# EAGLE design 4X EGT Display Meduino (EAGLE 9.0.1)
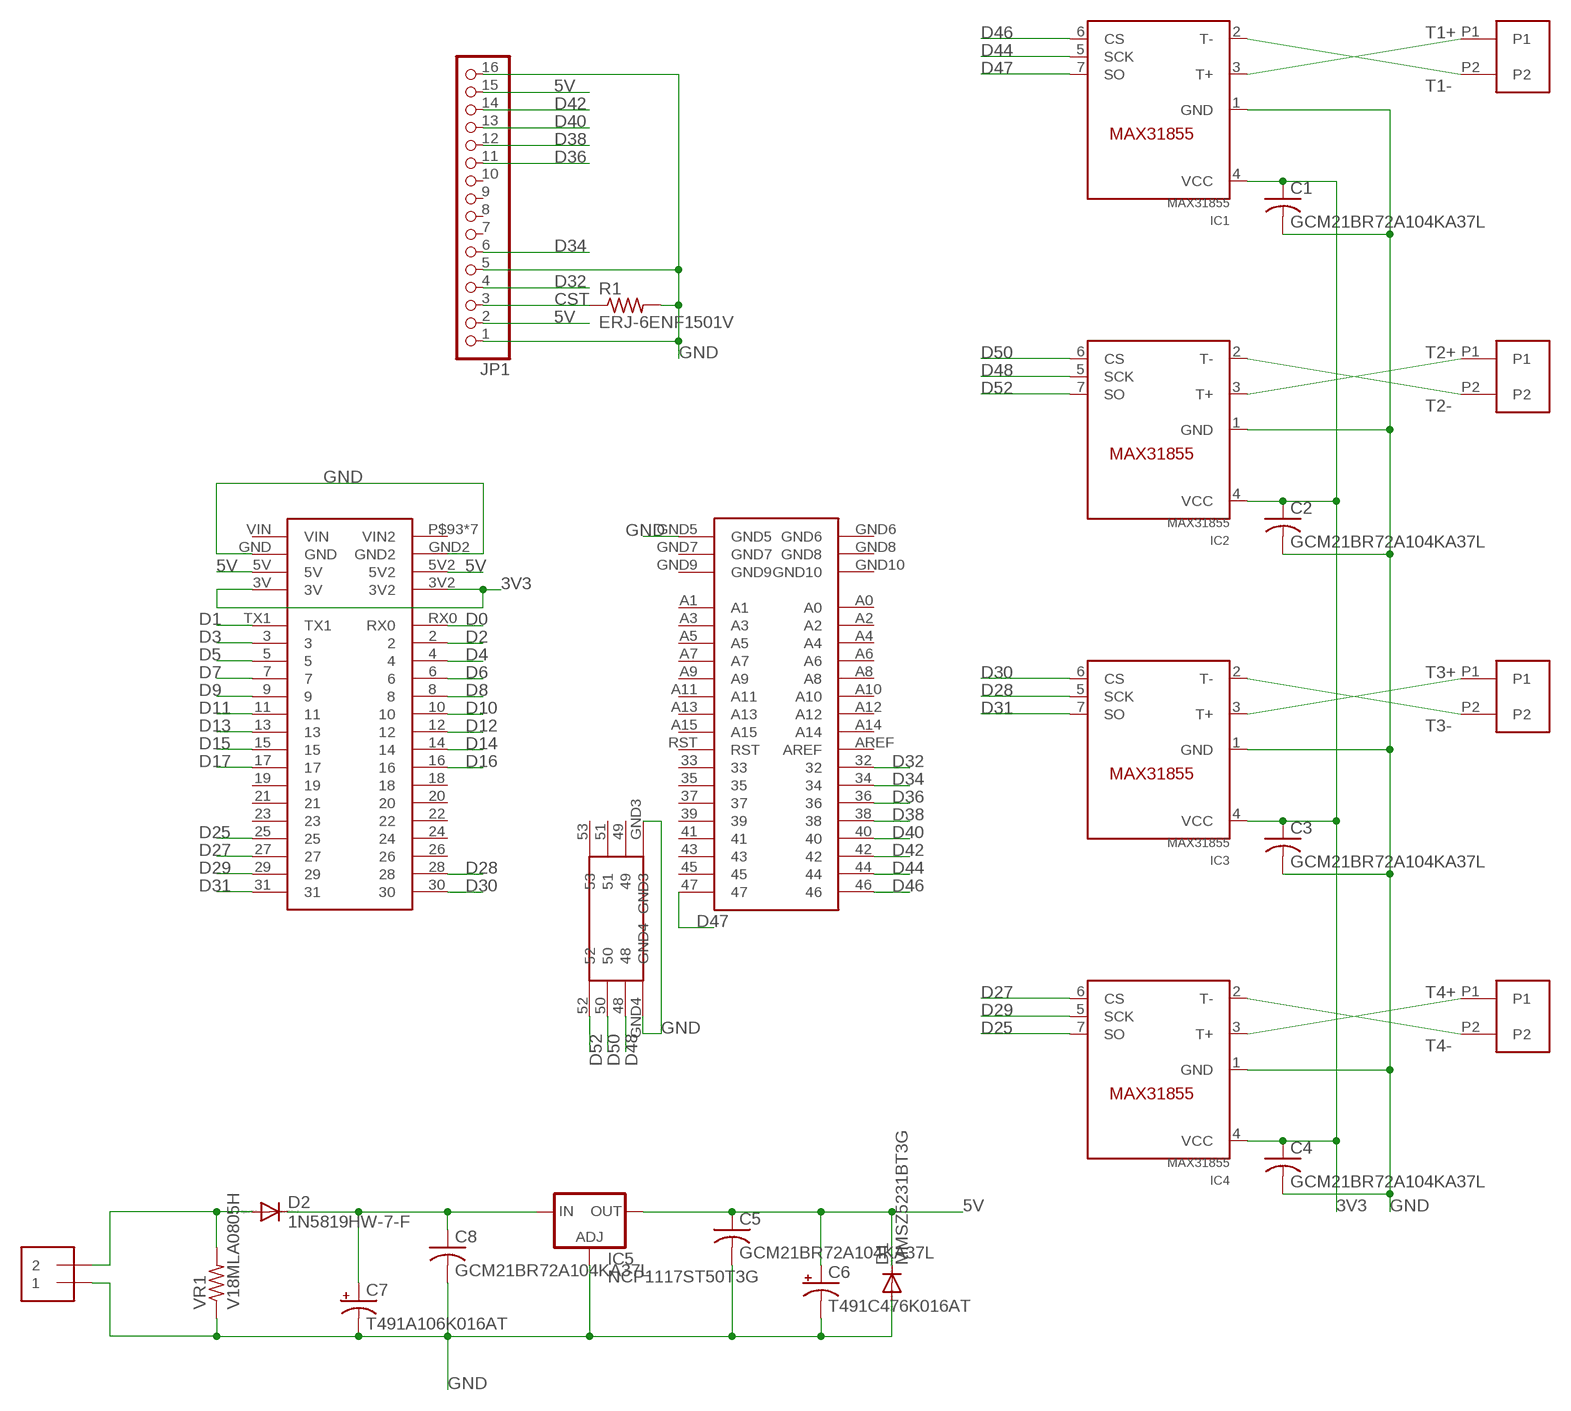
[diagram p0: schematic, sheet 1]

## Parts
C1  GCM21BR72A104KA37L  C-USC0805K  [C0805K]
C2  GCM21BR72A104KA37L  C-USC0805K  [C0805K]
C3  GCM21BR72A104KA37L  C-USC0805K  [C0805K]
C4  GCM21BR72A104KA37L  C-USC0805K  [C0805K]
C5  GCM21BR72A104KA37L  C-USC0805K  [C0805K]
C6  T491C476K016AT  CPOL-USCT6032  [CT6032]
C7  T491A106K016AT  CPOL-USA/3216-18R  [A/3216-18R]
C8  GCM21BR72A104KA37L  C-USC0805K  [C0805K]
D1  MMSZ5231BT3G  DIODE-SOD123  [SOD123]
D2  1N5819HW-7-F  DIODE-SOD123  [SOD123]
IC1  MAX31855  [SOIC8]
IC2  MAX31855  [SOIC8]
IC3  MAX31855  [SOIC8]
IC4  MAX31855  [SOIC8]
IC5  NCP1117ST50T3G  LD117AS50TR  [SOT223]
JP1  PINHD-1X16  [1X16]
PWR  1X2-3.5MM  [1X2-3.5MM]
R1  ERJ-6ENF1501V  R-US_R0805  [R0805]
T1  SPTAF_2  [SPTAF_2]
T2  SPTAF_2  [SPTAF_2]
T3  SPTAF_2  [SPTAF_2]
T4  SPTAF_2  [SPTAF_2]
U$1  MEDUINO  [MEDUINO]
VR1  V18MLA0805H  R-US_R0805  [R0805]

## Nets
3V3: C1.1 C2.1 C3.1 C4.1 IC1.4(VCC) IC2.4(VCC) IC3.4(VCC) IC4.4(VCC) U$1.3V U$1.3V2
5V: C5.1 C6.+ D1.C IC5.4(OUT) JP1.2 JP1.15 U$1.5V U$1.5V2
12V: C7.+ C8.1 D2.C IC5.3(IN)
12V-RAW: D2.A PWR.2 VR1.2
CST: JP1.3 R1.1
D0: U$1.RX0
D1: U$1.TX1
D2: U$1.2
D3: U$1.3
D4: U$1.4
D5: U$1.5
D6: U$1.6
D7: U$1.7
D8: U$1.8
D9: U$1.9
D10: U$1.10
D11: U$1.11
D12: U$1.12
D13: U$1.13
D14: U$1.14
D15: U$1.15
D16: U$1.16
D17: U$1.17
D25: IC4.7(SO) U$1.25
D27: IC4.6(CS) U$1.27
D28: IC3.5(SCK) U$1.28
D29: IC4.5(SCK) U$1.29
D30: IC3.6(CS) U$1.30
D31: IC3.7(SO) U$1.31
D32: JP1.4 U$1.32
D34: JP1.6 U$1.34
D36: JP1.11 U$1.36
D38: JP1.12 U$1.38
D40: JP1.13 U$1.40
D42: JP1.14 U$1.42
D44: IC1.5(SCK) U$1.44
D46: IC1.6(CS) U$1.46
D47: IC1.7(SO) U$1.47
D48: IC2.5(SCK) U$1.48
D50: IC2.6(CS) U$1.50
D52: IC2.7(SO) U$1.52
GND: C1.2 C2.2 C3.2 C4.2 C5.2 C6.- C7.- C8.2 D1.A IC1.1(GND) IC2.1(GND) IC3.1(GND) IC4.1(GND) IC5.1(ADJ) JP1.1 JP1.5 JP1.16 PWR.1 R1.2 U$1.GND U$1.GND2 U$1.GND3 U$1.GND4 U$1.GND5 VR1.1
T1+: IC1.3(T+) T1.P1
T1-: IC1.2(T-) T1.P2
T2+: IC2.3(T+) T2.P1
T2-: IC2.2(T-) T2.P2
T3+: IC3.3(T+) T3.P1
T3-: IC3.2(T-) T3.P2
T4+: IC4.3(T+) T4.P1
T4-: IC4.2(T-) T4.P2
Unconnected: JP1.7 JP1.8 JP1.9 JP1.10 U$1.18 U$1.19 U$1.20 U$1.21 U$1.22 U$1.23 U$1.24 U$1.26 U$1.33 U$1.35 U$1.37 U$1.39 U$1.41 U$1.43 U$1.45 U$1.49 U$1.51 U$1.53 U$1.A0 U$1.A1 U$1.A2 U$1.A3 U$1.A4 U$1.A5 U$1.A6 U$1.A7 U$1.A8 U$1.A9 U$1.A10 U$1.A11 U$1.A12 U$1.A13 U$1.A14 U$1.A15 U$1.AREF U$1.GND6 U$1.GND7 U$1.GND8 U$1.GND9 U$1.GND10 U$1.P$93(VIN2) U$1.P$94(VIN2) U$1.P$95(VIN2) U$1.P$96(VIN2) U$1.P$97(VIN2) U$1.P$98(VIN2) U$1.RST U$1.VIN U$1.VIN2

## Library data of the parts
C1-C5 C8 = adafruit:C-US: CAPACITOR, American symbol
C6 C7 = adafruit:CPOL-US: POLARIZED CAPACITOR, American symbol
D1 D2 = diode:DIODE-: DIODE
IC1-IC4 = AlexW-Eagle-Libraries:MAX31855
IC5 = v-reg:LD117A?*: Low drop fixed and adjustable positive voltage regulators 1 A Source: http://www.st.com/stonline/products/literature/ds/7194/ld1117axx.pdf
JP1 = pinhead:PINHD-1X16: PIN HEADER
PWR = adafruit:1X2: 3.5mm Terminal block http://www.ladyada.net/library/pcb/eaglelibrary.html
R1 VR1 = adafruit:R-US_: RESISTOR, American symbol
T1-T4 = SPTAF:SPTAF_2
U$1 = MEDUINO:MEDUINO

## Board
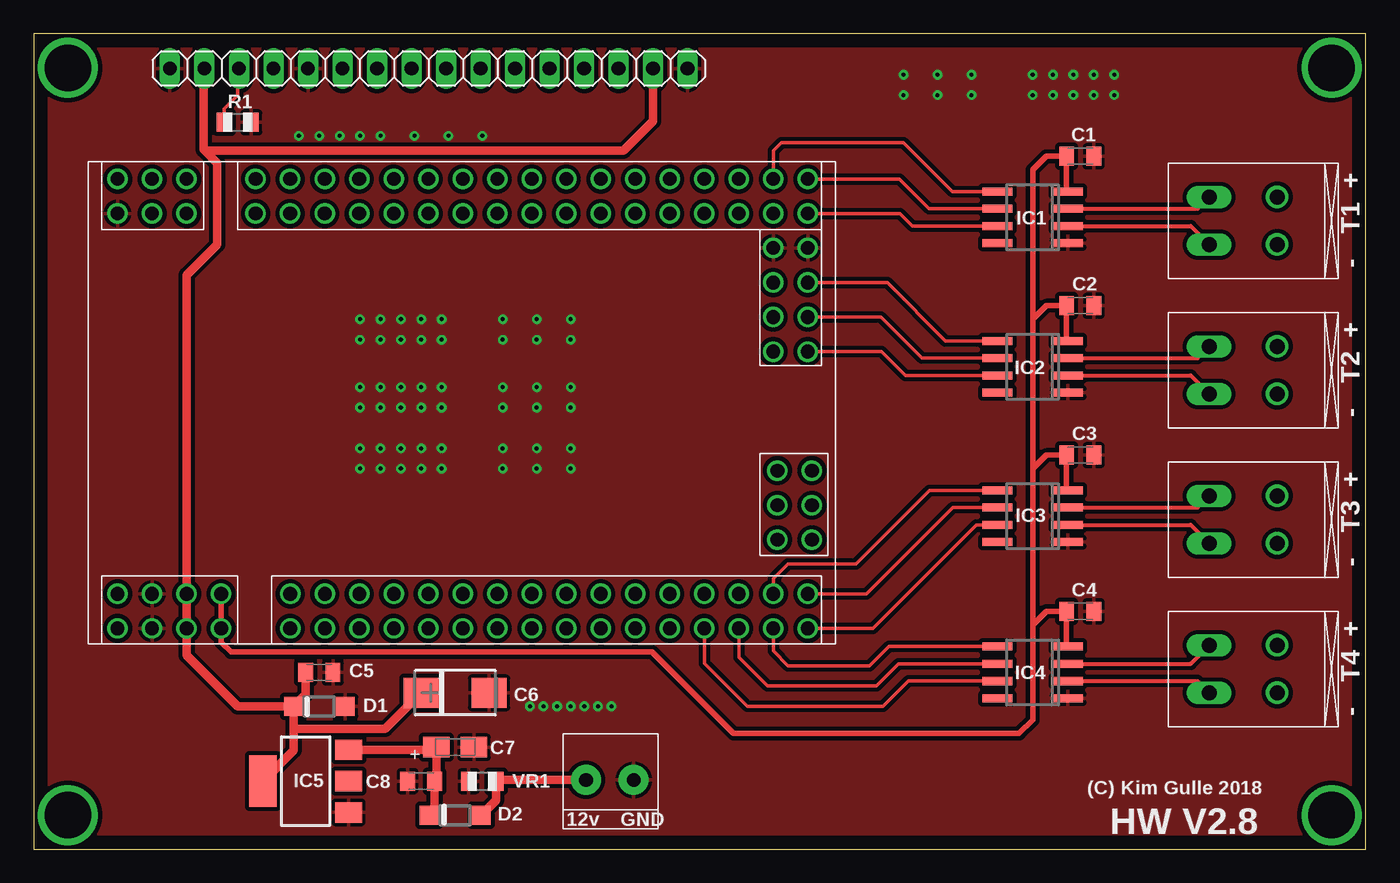
[diagram p1: board, top side]
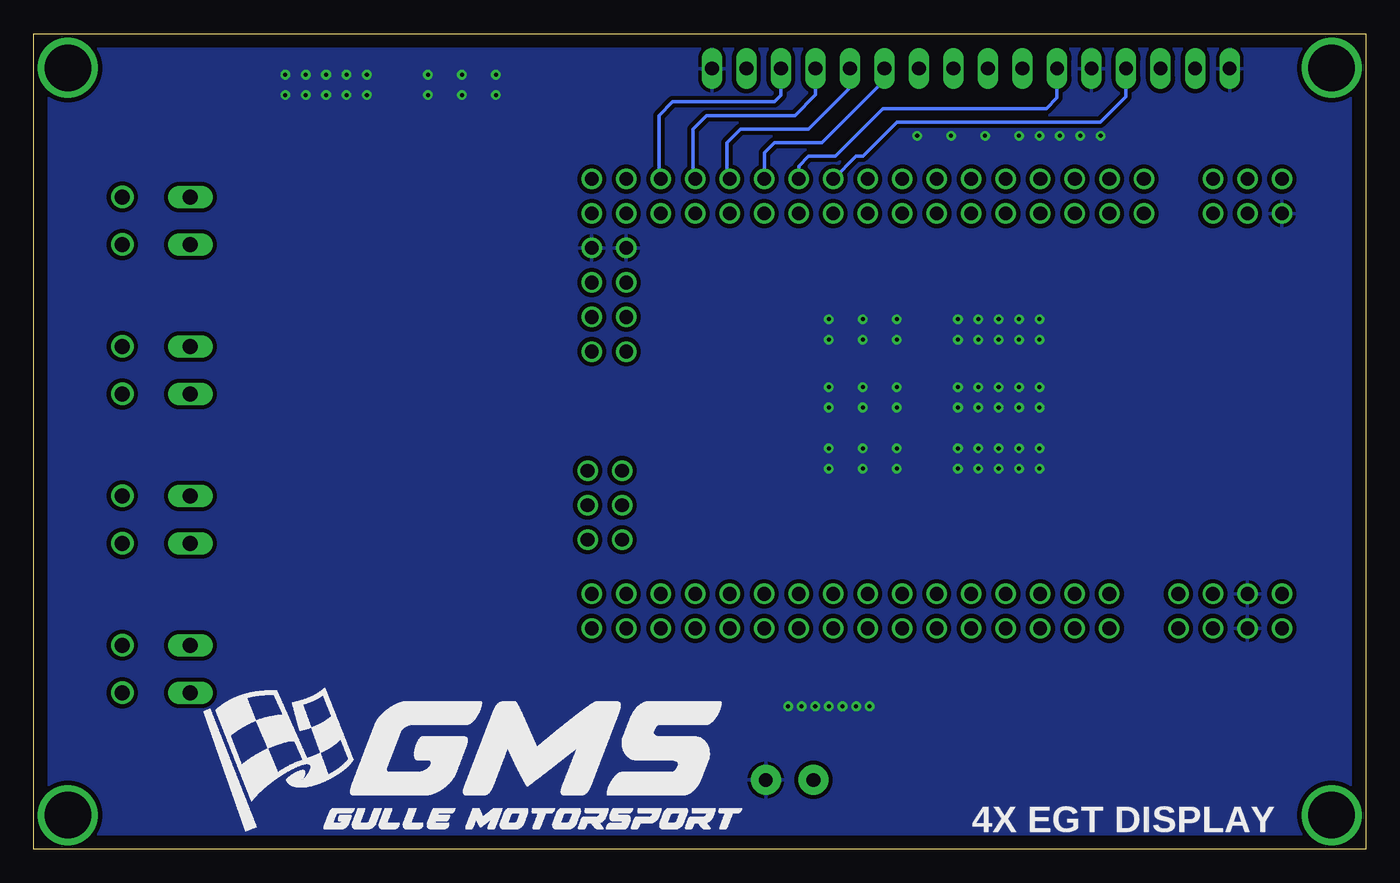
[diagram p2: board, bottom side, seen from below]

Size 98 x 60 mm. Coordinates in mm from the lower left corner, seen from the top.
Outline: 0,0 98,0 98,60 0,60 0,0
Copper layers (1*16): Top 0.035mm / dielectric 1.5mm / Bottom 0.035mm
Design rules "default *": minimum track width 6mil, minimum drill 0.35mm, track to track 12mil, track to pad 12mil, pad to pad 12mil, via to via 12mil, smd to smd 12mil, copper to edge 40mil, drill to drill 12mil, minimum pad ring 10mil, minimum via ring 8mil, stop-mask expansion 4mil, vias tented up to drill 20mil, thermal gap 10mil

### Footprints (pad centres in the part's own frame; a part is rotated, then mirrored left to right if it is on the bottom)
C0805K = smd 1.1 x 1.4: 1 -1,0; 2 1,0
CT6032 = smd 2.6 x 2.2: + 2.5,0; - -2.5,0
A/3216-18R = smd 1.95 x 1.5: + 1.375,0; - -1.375,0
SOD123 = smd 1.4 x 1.4: A 1.9,0; C -1.9,0
SOIC8 = smd 0.6 x 2.2: 1 -1.905,-2.6; 2 -0.635,-2.6; 3 0.635,-2.6; 4 1.905,-2.6; 5 1.905,2.6; 6 0.635,2.6; 7 -0.635,2.6; 8 -1.905,2.6
SOT223 = smd 1.5 x 2: 1 -2.3,-3.15; 2 0,-3.15; 3 2.3,-3.15 | smd 3.8 x 2: 4 0,3.15
1X16 = drill 1.016 long: 1 -19.05,0; 2 -16.51,0; 3 -13.97,0; 4 -11.43,0; 5 -8.89,0; 6 -6.35,0; 7 -3.81,0; 8 -1.27,0; 9 1.27,0; 10 3.81,0; 11 6.35,0; 12 8.89,0; 13 11.43,0; 14 13.97,0; 15 16.51,0; 16 19.05,0
1X2-3.5MM = drill 1 pad 2.184: 1 1.8,0; 2 -1.7,0
R0805 = smd 1.1 x 1.4: 1 -1,0; 2 1,0
SPTAF_2 = drill 1.1 long: P1 21,21; P2 21,17.5 | drill 1.1: P$3 26,17.5; P$4 26,21
MEDUINO = drill 1: 2 -20.318,5.083; 3 -22.858,5.083; 3V -22.858,12.703; 3V2 -20.318,12.703; 4 -20.318,2.543; 5 -22.858,2.543; 5V -22.858,15.243; 5V2 -20.318,15.243; 6 -20.318,0.003; 7 -22.858,0.003; 8 -20.318,-2.537; 9 -22.858,-2.537; 10 -20.318,-5.077; 11 -22.858,-5.077; 12 -20.318,-7.617; 13 -22.858,-7.617; 14 -20.318,-10.157; 15 -22.858,-10.157; 16 -20.318,-12.697; 17 -22.858,-12.697; 18 -20.318,-15.237; 19 -22.858,-15.237; 20 -20.318,-17.777; 21 -22.858,-17.777; 22 -20.318,-20.317; 23 -22.858,-20.317; 24 -20.318,-22.857; 25 -22.858,-22.857; 26 -20.318,-25.397; 27 -22.858,-25.397; 28 -20.318,-27.937; 29 -22.858,-27.937; 30 -20.318,-30.477; 31 -22.858,-30.477; 32 10.22,-12.693; 33 7.68,-12.693; 34 10.22,-15.233; 35 7.68,-15.233; 36 10.22,-17.773; 37 7.68,-17.773; 38 10.22,-20.313; 39 7.68,-20.313; 40 10.22,-22.853; 41 7.68,-22.853; 42 10.22,-25.393; 43 7.68,-25.393; 44 10.22,-27.933; 45 7.68,-27.933; 46 10.22,-30.473; 47 7.68,-30.473; 48 2.6,-30.473; 49 2.6,-27.933; 50 0.06,-30.473; 51 0.06,-27.933; 52 -2.48,-30.473; 53 -2.48,-27.933; A0 10.22,10.167; A1 7.68,10.167; A2 10.22,7.627; A3 7.68,7.627; A4 10.22,5.087; A5 7.68,5.087; A6 10.22,2.547; A7 7.68,2.547; A8 10.22,0.007; A9 7.68,0.007; A10 10.22,-2.533; A11 7.68,-2.533; A12 10.22,-5.073; A13 7.68,-5.073; A14 10.22,-7.613; A15 7.68,-7.613; AREF 10.22,-10.153; GND -22.858,17.783; GND2 -20.318,17.783; GND3 5.14,-27.933; GND4 5.14,-30.473; GND5 7.68,20.327; GND6 10.22,20.327; GND7 7.68,17.787; GND8 10.22,17.787; GND9 7.68,15.247; GND10 10.22,15.247; P$93 -16.323,-30.778; P$94 -13.783,-30.778; P$95 -11.243,-30.778; P$96 -16.323,-28.238; P$97 -13.783,-28.238; P$98 -11.243,-28.238; RST 7.68,-10.153; RX0 -20.318,7.623; TX1 -22.858,7.623; VIN -22.858,20.323; VIN2 -20.318,20.323

### Placement (x,y rotation side)
C1  77,51 0 top
C2  77,40 0 top
C3  77,29 0 top
C4  77,17.5 0 top
C5  21,13 0 top
C6  31,11.5 180 top
C7  31,7.5 180 top
C8  28.5,5 180 top
D1  21,10.5 0 top
D2  31,2.5 0 top
IC1  73.5,46.5 90 top
IC2  73.5,35.5 90 top
IC3  73.5,24.5 90 top
IC4  73.5,13 90 top
IC5  20,5 90 top
JP1  29.05,57.46 0 top
PWR  42.33,5.09 0 top
R1  15,53.5 0 top
T1  65.5,27 0 top
T2  65.5,16 0 top
T3  65.5,5 0 top
T4  65.5,-6 0 top
U$1  26.48,39.1 90 top
VR1  33,5 0 top

### Tracks (layer width: path | path; a pad name or v marks a point on that pad's centre or on a via)
3V3
  Top 0.406: IC1.4 76,48.51 C1.1 74.5,51 73.5,50 73.5,39 | IC2.4 76,37.51 C2.1 74.5,40 73.5,39 | IC3.4 76,26.5 C3.1 74.5,29 73.5,28 | IC4.4 76,15.01 C4.1 74.5,17.5 73.5,16.5 | U$1.3V2 U$1.3V 13.78,15.22 14.5,14.5 45.5,14.5 51.5,8.5 72.5,8.5 73.5,9.5 73.5,16.5 | 73.5,16.5 73.5,28 | 73.5,28 73.5,39
5V
  Top 0.61: IC5.4 19.1,7.25 19.1,8.86 | 19.1,8.86 D1.C | D1.C 20,11.4 C5.1 | 12.6,51.41 12.5,51.5 12.5,57.41 JP1.2 | D1.C 15,10.5 11.24,14.26 U$1.5V U$1.5V2 11.24,42.24 13.5,44.5 13.5,50.5 12.6,51.41 | C6.+ 25.86,8.86 19.1,8.86 | JP1.15 45.56,53.56 43.41,51.41 12.6,51.41
12V
  Top 0.61: D2.C 29.5,2.9 C8.1 29.62,5.12 C7.+ 29.43,7.3 IC5.3
12V-RAW
  Top 0.61: PWR.2 34.09,5.09 VR1.2 34,3.6 D2.A
CST
  Top 0.254: JP1.3 15,57.38 15,55.5 14,54.5 R1.1
D25
  Top 0.254: IC4.7 64.36,12.37 62.5,10.5 52.5,10.5 49.34,13.66 U$1.25
D27
  Top 0.254: IC4.6 63.63,13.63 62,12 54,12 51.88,14.12 U$1.27
D28
  Top 0.254: IC3.5 65.91,26.41 60.5,21 55.5,21 54.42,19.92 U$1.28
D29
  Top 0.254: IC4.5 62.91,14.9 61.5,13.5 55.5,13.5 54.42,14.58 U$1.29
D30
  Top 0.254: U$1.30 59.5,18.78 59.78,18.78 61.28,18.78 67.64,25.14 IC3.6
D31
  Top 0.254: IC3.7 69.36,23.86 61.74,16.24 U$1.31
D32
  Bottom 0.254: JP1.4 17.62,55.38 19.5,53.5 34.5,53.5 37,51 37.5,51 U$1.32
D34
  Bottom 0.254: 22.65,57.41 JP1.6 22.7,55.3 23.5,54.5 35.5,54.5 39,51 41,51 41.71,50.29 U$1.34
D36
  Bottom 0.254: 35.36,57.41 JP1.11 35.41,56.59 40,52 43.5,52 44.25,51.25 U$1.36
D38
  Bottom 0.254: 37.91,57.42 JP1.12 37.95,56.05 41,53 46,53 47,52 47,49.53 U$1.38
D40
  Bottom 0.254: 40.47,57.44 JP1.13 40.48,55.52 42,54 48.5,54 49.5,53 49.5,49.49 U$1.40
D42
  Bottom 0.254: 42.98,57.41 JP1.14 43.02,55.48 43.5,55 51,55 52,54 52,49.45 U$1.42
D44
  Top 0.254: IC1.5 67.59,48.41 64,52 55,52 54.41,51.41 U$1.44
D46
  Top 0.254: IC1.6 65.86,47.13 63.68,49.32 U$1.46
D47
  Top 0.254: IC1.7 64.64,45.87 63.72,46.78 U$1.47
D48
  Top 0.254: IC2.5 67.09,37.41 62.8,41.7 U$1.48
D50
  Top 0.254: IC2.6 65.36,36.13 62.34,39.16 U$1.50
D52
  Top 0.254: IC2.7 64.14,34.87 62.38,36.62 U$1.52
GND  (via drill 0.3)
  other vias: 24,34 25.5,34 27,34 28.5,34 30,34 24,32.5 25.5,32.5 27,32.5 28.5,32.5 30,32.5 34.5,34 34.5,32.5 37,34 37,32.5 39.5,34 39.5,32.5 33,52.5 30.5,52.5 28,52.5 36.5,10.5 37.5,10.5 38.5,10.5 39.5,10.5 40.5,10.5 41.5,10.5 42.5,10.5 25.5,52.5 24,52.5 22.5,52.5 21,52.5 19.5,52.5 24,29.5 25.5,29.5 27,29.5 28.5,29.5 30,29.5 24,28 25.5,28 27,28 28.5,28 30,28 34.5,29.5 34.5,28 37,29.5 37,28 39.5,29.5 39.5,28 24,39 25.5,39 27,39 28.5,39 30,39 24,37.5 25.5,37.5 27,37.5 28.5,37.5 30,37.5 34.5,39 34.5,37.5 37,39 37,37.5 39.5,39 39.5,37.5 79.5,55.5 78,55.5 76.5,55.5 75,55.5 73.5,55.5 79.5,57 78,57 76.5,57 75,57 73.5,57 69,55.5 69,57 66.5,55.5 66.5,57 64,55.5 64,57
  pour Top: -0.5,60.5 99,60.5 99,-0.5 -0.5,-0.5
  pour Bottom: -1,61 -1,-1 99,-1 99,61
N$1  (via drill 3.4)
  other vias: 95.5,2.5
N$2  (via drill 3.4)
  other vias: 2.5,57.5
N$3  (via drill 3.4)
  other vias: 2.5,2.5
N$4  (via drill 3.4)
  other vias: 95.5,57.5
T1+
  Top 0.305: IC1.3 85.64,47.13 T1.P1
T1-
  Top 0.305: IC1.2 85.14,45.87 T1.P2
T2+
  Top 0.305: IC2.3 85.64,36.13 T2.P1
T2-
  Top 0.305: IC2.2 85.14,34.87 T2.P2
T3+
  Top 0.305: IC3.3 85.64,25.14 T3.P1
T3-
  Top 0.305: IC3.2 85.14,23.86 T3.P2
T4+
  Top 0.305: IC4.3 85.14,13.63 T4.P1
T4-
  Top 0.305: IC4.2 85.64,12.37 T4.P2

### Text on the board
tNames: + | T1 | - | + | T2 | - | + | T3 | - | + | T4 | - | (C) Kim Gulle 2018 | 12v | GND | HW V2.8
bNames: 4X EGT DISPLAY